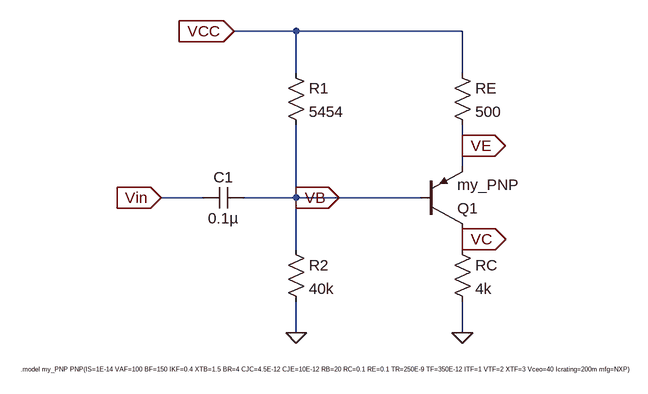
[diagram p0: schematic CED_pnp_Q3.asc]
CED_pnp_Q3.asc, the LTspice schematic file:
Version 4
SHEET 1 2272 688
WIRE 208 32 112 32
WIRE 464 32 208 32
WIRE 208 96 208 32
WIRE 464 96 464 32
WIRE 464 208 464 176
WIRE 464 240 464 208
WIRE 64 288 0 288
WIRE 208 288 208 176
WIRE 208 288 128 288
WIRE 400 288 208 288
WIRE 464 352 464 336
WIRE 208 368 208 288
WIRE 464 368 464 352
WIRE 208 496 208 448
WIRE 464 496 464 448
FLAG 208 496 0
FLAG 464 496 0
FLAG 0 288 Vin
IOPIN 0 288 In
FLAG 208 288 VB
IOPIN 208 288 Out
FLAG 464 208 VE
IOPIN 464 208 Out
FLAG 464 352 VC
IOPIN 464 352 Out
FLAG 112 32 VCC
IOPIN 112 32 In
SYMBOL Res 192 80 R0
SYMATTR InstName R1
SYMATTR Value 5454
SYMBOL Res 192 352 R0
SYMATTR InstName R2
SYMATTR Value 40k
SYMBOL Res 448 80 R0
SYMATTR InstName RE
SYMATTR Value 500
SYMBOL Cap 128 272 R90
WINDOW 0 0 32 VBottom 2
WINDOW 3 32 32 VTop 2
SYMATTR InstName C1
SYMATTR Value 0.1µ
SYMBOL Res 448 352 R0
SYMATTR InstName RC
SYMATTR Value 4k
SYMBOL pnp 400 336 M180
SYMATTR InstName Q1
SYMATTR Value my_PNP
TEXT -216 552 Left 0 !.model my_PNP PNP(IS=1E-14 VAF=100 BF=150 IKF=0.4 XTB=1.5 BR=4 CJC=4.5E-12 CJE=10E-12 RB=20 RC=0.1 RE=0.1 TR=250E-9 TF=350E-12 ITF=1 VTF=2 XTF=3 Vceo=40 Icrating=200m mfg=NXP)

The netlist it stands for:
* CED_pnp_Q3.asc
R1 VCC VB 5454
R2 VB 0 40k
RE VCC VE 500
C1 VB Vin 0.1µ
RC VC 0 4k
Q1 VC VB VE 0 my_PNP
.model NPN NPN
.model PNP PNP
.lib standard.bjt
.model my_PNP PNP(IS=1E-14 VAF=100 BF=150 IKF=0.4 XTB=1.5 BR=4 CJC=4.5E-12 CJE=10E-12 RB=20 RC=0.1 RE=0.1 TR=250E-9 TF=350E-12 ITF=1 VTF=2 XTF=3 Vceo=40 Icrating=200m mfg=NXP)
.backanno
.end